# EAGLE schematic main (EAGLE 8.7.1)
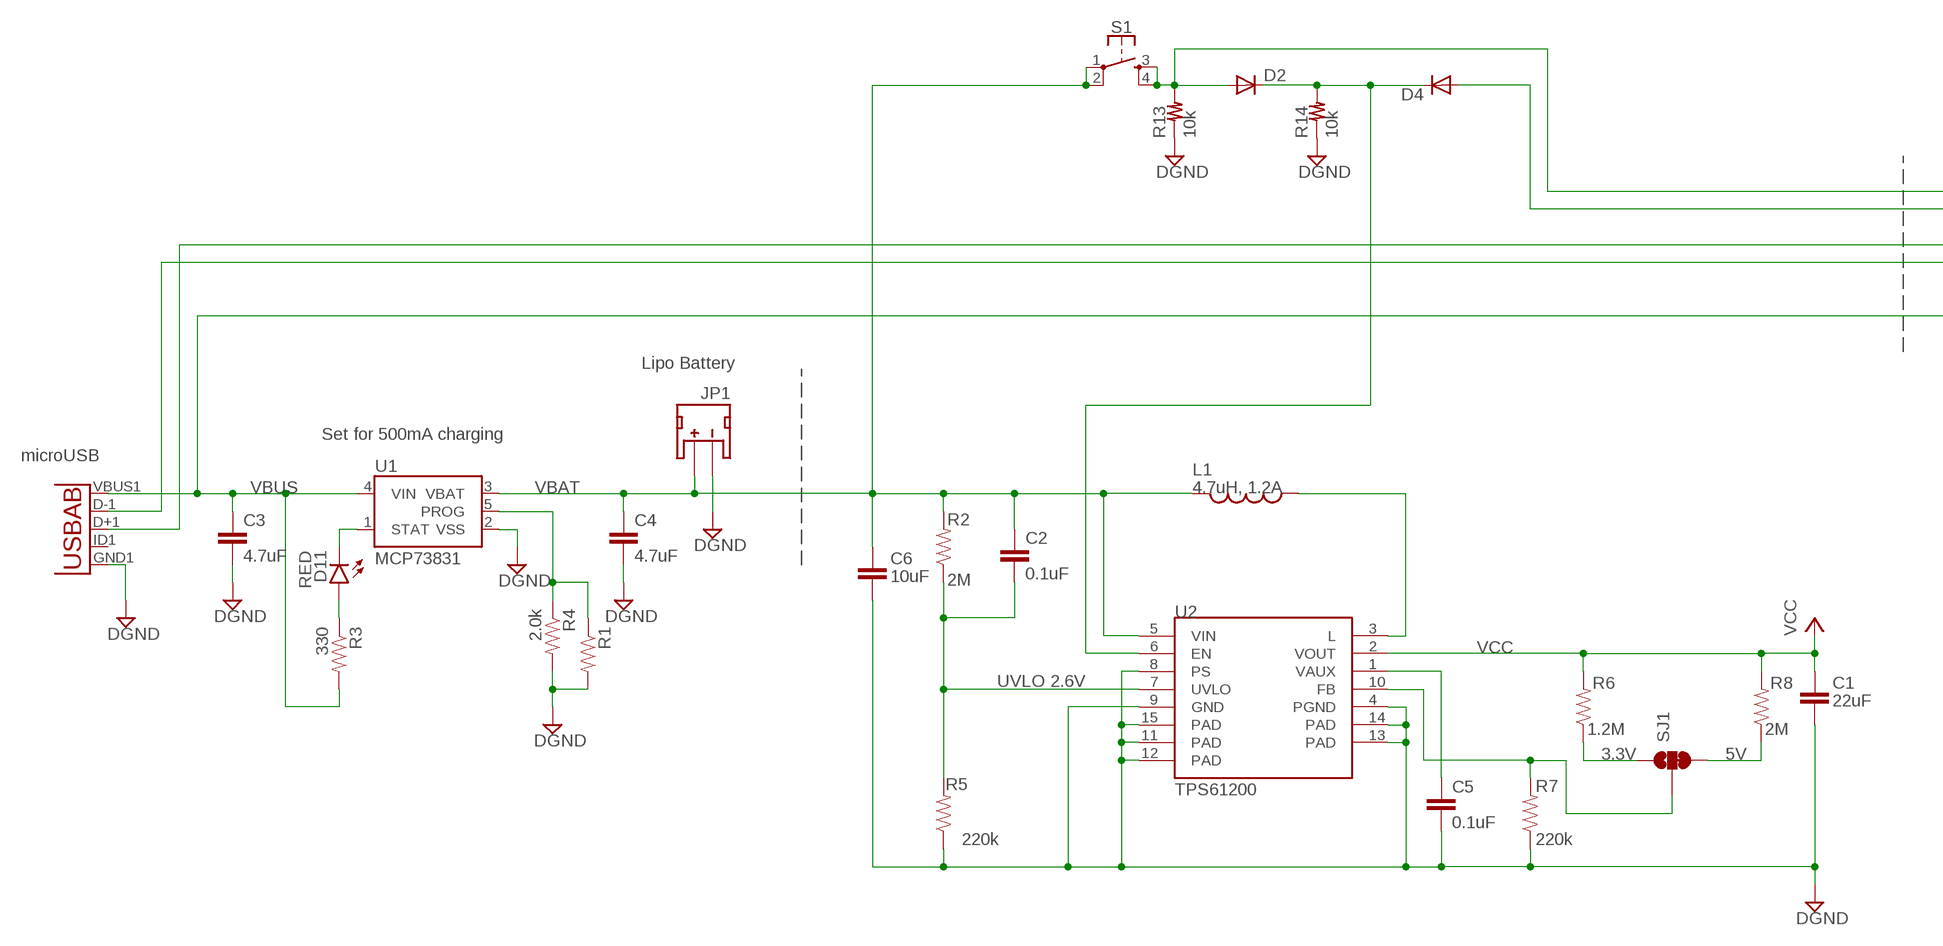
[diagram p0: schematic, sheet 1, part 1 of 2]
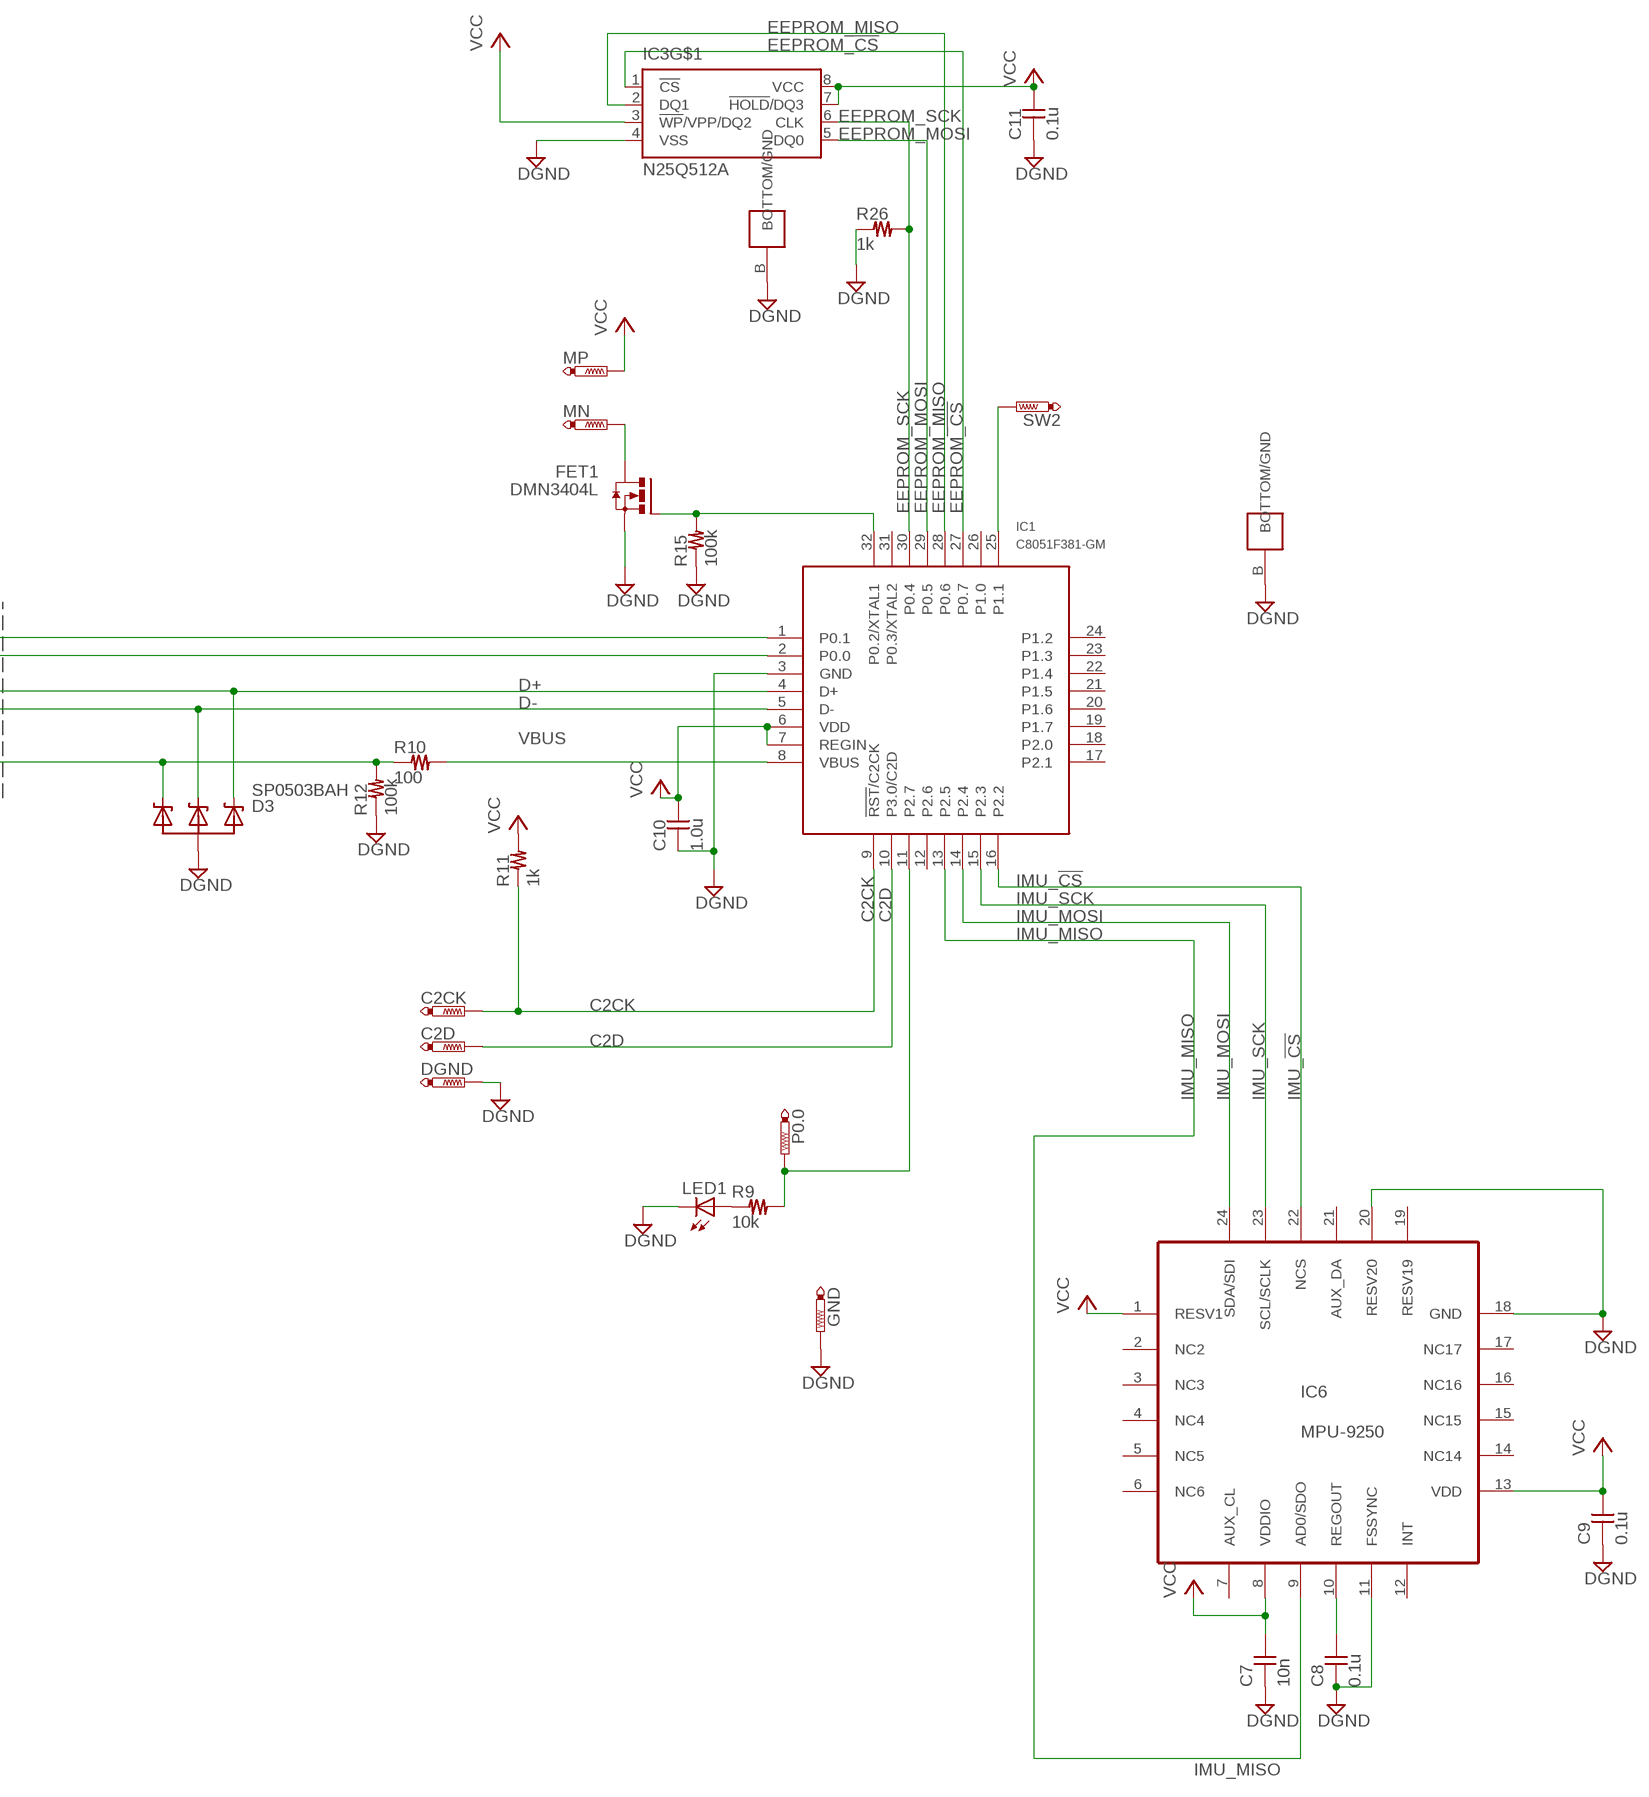
[diagram p1: schematic, sheet 1, part 2 of 2]

## Parts
C1  22uF  CAP0805  [0805]
C2  0.1uF  CAP0603-CAP  [0603-CAP]
C2CK  PTR1TP10R  [TP10R]
C2D  PTR1TP10R  [TP10R]
C3  4.7uF  4.7UF-6.3V-10%(0603)0603  [0603-CAP]
C4  4.7uF  4.7UF-6.3V-10%(0603)0603  [0603-CAP]
C5  0.1uF  CAP0603-CAP  [0603-CAP]
C6  10uF  CAP1206  [1206]
C7  10n  C-1005  [1005]
C8  0.1u  C-1005  [1005]
C9  0.1u  C-1005  [1005]
C10  1.0u  C-1005  [1005]
C11  0.1u  C-1005  [1005]
D2  DIODE-SOD323-W  [SOD323-W]
D3  SP0503BAH  [SOT143]
D4  DIODE-SOD323-W  [SOD323-W]
D11  RED  LED-RED0603  [LED-0603]
DGND  PTR1TP10R  [TP10R]
FET1  DMN3404L  [SOT23]
GND  PTR1TP10R  [TP10R]
IC1  C8051F381-GM  [QFN32]
IC3  N25Q512A  [V-PDFN-8]
IC6  MPU-9250  [QFN-24]
JP1  JST  JST_2MM_MALE  [JST-2-SMD]
JP9  Micro USB  USB-ABCONN-11794  [USB-AB-MICRO-SMD_V03]
L1  4.7uH, 1.2A  INDUCTOR.  [CDRH2D09]
LED1  LED1608O  [1608-OLI]
MN  PTR1TP10R  [TP10R]
MP  PTR1TP10R  [TP10R]
P0.0  PTR1TP10R  [TP10R]
R1  2.0KOHM1/10W5%(0603)  [0603-RES]
R2  2M  RESISTOR0603-RES  [0603-RES]
R3  330  330OHM1/10W1%(0603)  [0603-RES]
R4  2.0k  2.0KOHM1/10W5%(0603)  [0603-RES]
R5  220k  RESISTOR0603-RES  [0603-RES]
R6  1.2M  RESISTOR0603-RES  [0603-RES]
R7  220k  RESISTOR0603-RES  [0603-RES]
R8  2M  RESISTOR0603-RES  [0603-RES]
R9  10k  R-1005  [1005]
R10  100  R-1005  [1005]
R11  1k  R-1005  [1005]
R12  100k  R-1005  [1005]
R13  10k  R-1005  [1005]
R14  10k  R-1005  [1005]
R15  100k  R-1005  [1005]
R26  1k  R-1005  [1005]
S1  MOMENTARY-SWITCH-SPST-2-SMD-4.6X2.8MM  [TACTILE_SWITCH_SMD_4.6X2.8MM]
SJ1  SOLDERJUMPER_2WAYPASTE2&3  [SJ_3_PASTE2&3]
SW2  PTR1TP10R  [TP10R]
U1  MCP73831  [SOT23-5]
U2  TPS61200  [QFN-10_PAD]

## Nets
3.3V: R6.1 SJ1.1
5V: R8.1 SJ1.3
C2CK: C2CK.TP IC1.9(!RST!/C2CK) R11.P$1
C2D: C2D.TP IC1.10(P3.0/C2D)
D+: D3.2 IC1.4(D+) JP9.D+1(D+)
D-: D3.3 IC1.5(D-) JP9.D-1(D-)
DGND: C7.P$1 C8.P$1 C9.P$1 C10.P$1 C11.P$1 D3.1 DGND.TP FET1.S GND.TP IC1.3(GND) IC1.B(BOTTOM/GND) IC3.4(VSS) IC3.B(BOTTOM/GND) IC6.11(FSSYNC) IC6.18(GND) IC6.20(RESV20) LED1.K R12.P$1 R13.P$1 R14.P$1 R15.P$1 R26.P$1
EEPROM_!CS: IC1.27(P0.7) IC3.1(!CS)
EEPROM_MISO: IC1.28(P0.6) IC3.2(DQ1)
EEPROM_MOSI: IC1.29(P0.5) IC3.5(DQ0)
EEPROM_SCK: IC1.30(P0.4) IC3.6(CLK) R26.P$2
FB: R7.2 SJ1.2 U2.10(FB)
GND: C1.2 C3.2 C4.2 C5.2 C6.2 JP1.1(-) JP9.GND1(GND) R1.2 R4.2 R5.1 R7.1 U1.2(VSS) U2.4(PGND) U2.8(PS) U2.9(GND) U2.11(PAD) U2.12(PAD) U2.13(PAD) U2.14(PAD) U2.15(PAD) ; supply symbol labelled DGND
IMU_!CS: IC1.16(P2.2) IC6.22(NCS)
IMU_MISO: IC1.13(P2.5) IC6.9(AD0/SDO)
IMU_MOSI: IC1.14(P2.4) IC6.24(SDA/SDI)
IMU_SCK: IC1.15(P2.3) IC6.23(SCL/SCLK)
N$1: C5.1 U2.1(VAUX)
N$2: L1.P$1 U2.3(L)
N$3: D11.A R3.1
N$4: IC1.25(P1.1) SW2.TP
N$5: D2.A IC1.1(P0.1) R13.P$2 S1.3 S1.4
N$6: D2.C D4.C R14.P$2 U2.6(EN)
N$7: D4.A IC1.2(P0.0)
N$8: FET1.G IC1.32(P0.2/XTAL1) R15.P$2
N$9: LED1.A R9.P$1
N$10: FET1.D MN.TP
N$13: C8.P$2 IC6.10(REGOUT)
N$15: IC1.11(P2.7) P0.0.TP R9.P$2
N$18: IC1.8(VBUS) R10.P$2
PROG: R1.1 R4.1 U1.5(PROG)
STAT: D11.C U1.1(STAT)
UVLO: C2.2 R2.1 R5.2 U2.7(UVLO)
VBAT: C2.1 C4.1 C6.1 JP1.2(+) L1.P$2 R2.2 S1.1 S1.2 U1.3(VBAT) U2.5(VIN)
VBUS: C3.1 D3.4 JP9.VBUS1(VBUS) R3.2 R10.P$1 R12.P$2 U1.4(VIN)
VCC: C1.1 C7.P$2 C9.P$2 C10.P$2 C11.P$2 IC1.6(VDD) IC1.7(REGIN) IC3.3(!WP!/VPP/DQ2) IC3.7(!HOLD!/DQ3) IC3.8(VCC) IC6.1(RESV1) IC6.8(VDDIO) IC6.13(VDD) MP.TP R6.2 R8.2 R11.P$2 U2.2(VOUT)
Unconnected: IC1.12(P2.6) IC1.17(P2.1) IC1.18(P2.0) IC1.19(P1.7) IC1.20(P1.6) IC1.21(P1.5) IC1.22(P1.4) IC1.23(P1.3) IC1.24(P1.2) IC1.26(P1.0) IC1.31(P0.3/XTAL2) IC6.2(NC2) IC6.3(NC3) IC6.4(NC4) IC6.5(NC5) IC6.6(NC6) IC6.7(AUX_CL) IC6.12(INT) IC6.14(NC14) IC6.15(NC15) IC6.16(NC16) IC6.17(NC17) IC6.19(RESV19) IC6.21(AUX_DA) JP1.NC1(PAD1) JP1.NC2(PAD2) JP9.ID1(USBID)

## Notes on the sheet
- Lipo Battery
- Set for 500mA charging
- microUSB
- UVLO 2.6V

## Library data of the parts
C1 C6 = CH_passive:CAP: Capacitor Standard 0603 ceramic capacitor, and 0.1" leaded capacitor.
C2 C5 = SparkFun:CAP: Capacitor Standard 0603 ceramic capacitor, and 0.1" leaded capacitor.
C2CK C2D DGND GND MN MP P0.0 SW2 = testpad:PTR1: TEST PIN
C3 C4 = SparkFun-Capacitors:4.7UF-6.3V-10%(0603): CAP-08280; PROD_ID: CAP-08280
C7-C11 = reg,cap:C-
D2 D4 = diode:DIODE-: DIODE
D3 = diode:SP0503BAH
D11 = SparkFun-LED:LED-RED: Assorted Red LEDs LilyPad 1206- DIO-09912 1206- DIO-00809 0603- DIO-00819; PROD_ID: DIO-00819
FET1 = MOSFET:DMN3404L
IC1 = C8051F34x:C8051F381-GM
IC3 = EEPROM:N25Q512A
IC6 = GYRO:MPU-9250
JP1 = SparkFun-Connectors:JST_2MM_MALE: Mates to single-cell LiPo batteries. CONN-08352; PROD_ID: CONN-08352
JP9 = SparkFun-Connectors:USB-AB: This is a USB AB connector that is compatible with USB OTG. i.e. this connector can serve as a host or device; PROD_ID: CONN-11794
L1 = SparkFun:INDUCTOR: Inductors Basic Inductor/Choke - 0603 and 1206. Footprints are not proven and vary greatly between part numbers.
LED1 = LED:LED
R1 = SparkFun-Resistors:2.0KOHM1/10W5%(0603): RES-08296; PROD_ID: RES-08296; VALUE: 2.0k
R2 R5-R8 = SparkFun:RESISTOR: Resistor Basic schematic elements and footprints for 0603, 1206, and PTH resistors.
R3 = SparkFun-Resistors:330OHM1/10W1%(0603): RES-00818; PROD_ID: RES-00818
R4 = SparkFun-Resistors:2.0KOHM1/10W5%(0603): RES-08296; PROD_ID: RES-08296
R9-R15 R26 = reg,cap:R-
S1 = SparkFun-Switches:MOMENTARY-SWITCH-SPST-2: Momentary Switch (Pushbutton) - SPST - Two Circuits Normally-open (NO) SPST momentary switches (buttons, pushbuttons). Schematic symbol includes two switch circuits. Variants SMD-4.6MMX2.8MM - 4.60mm x 2.80mm Tactile Momentary Button Switch - Used on SparkFun SAMD21 Mini Breakout <https://www.sparkfun.com/products/13664> SMD-5.2MM - Mini Pushbutton Switch - SMD <https://www.sparkfun.com/products/8720> - Used on Arduino Pro Mini <https://www.sparkfun.com/products/11114>; PROD_ID: SWCH-13065
SJ1 = SparkFun:SOLDERJUMPER_2WAY: Solder Jumper 2 way solder jumper
U1 = SparkFun-PowerIC:MCP73831: Miniature single cell, fully integrated Li-Ion, Li-polymer charge management controller http://ww1.microchip.com/downloads/en/DeviceDoc/21984a.pdf IC-09995; PROD_ID: IC-09995
U2 = SparkFun:TPS61200: DC to DC Booster